# EAGLE design Bauble (EAGLE 7.6.0)

## Sheet 1 of 2
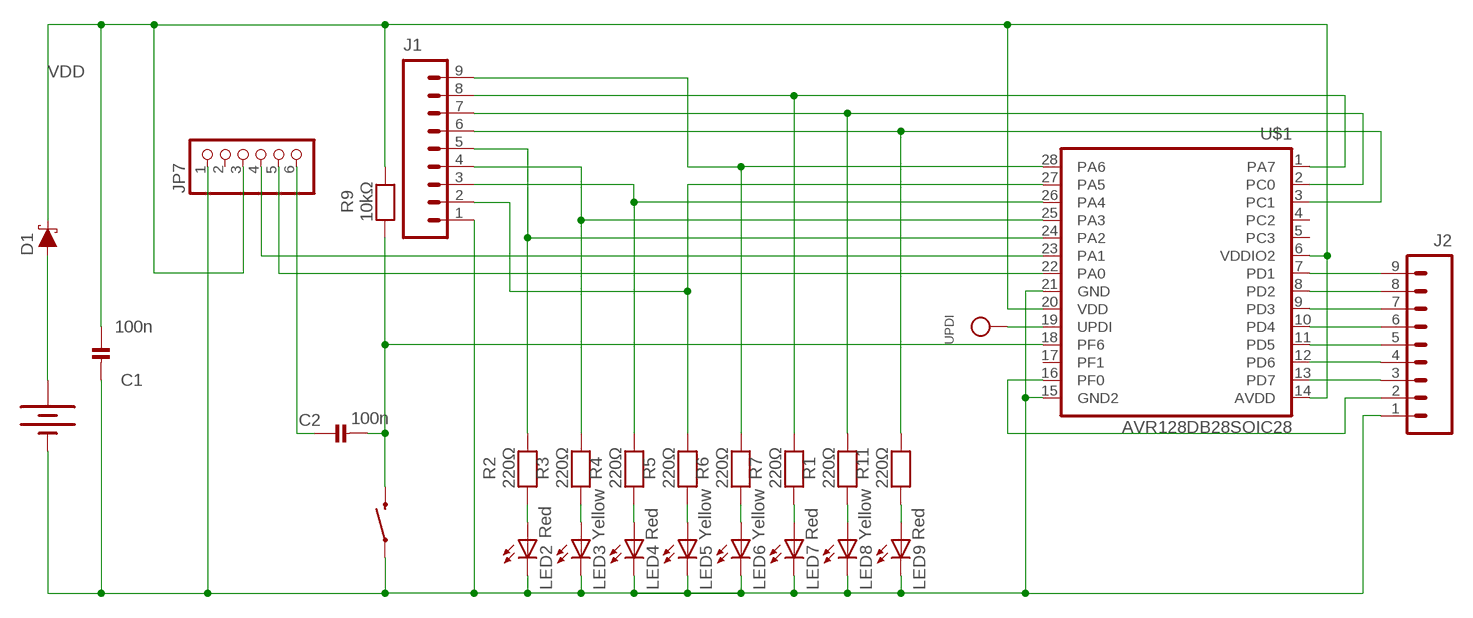
[diagram p0: schematic, sheet 1]

### Parts
BAT2  20mm coincell  BATTERY20MM_4LEGS  [BATTCON_20MM_4LEGS]
C1  100n  CAP_CERAMIC_0805MP  [_0805MP]
C2  100n  CAP_CERAMIC_0805MP  [_0805MP]
D1  3A/10V/280mV  DIODE-SCHOTTKY-BAT60A  [SOD-323]
J1  M82MM  [1X10-2MM]
J2  M82MM  [1X10-2MM]
JP7  HEADER-1X6ROUND  [1X06_ROUND]
LED2  Red  LEDCHIPLED_0805  [CHIPLED_0805]
LED3  Yellow  LEDCHIPLED_0805  [CHIPLED_0805]
LED4  Red  LEDCHIPLED_0805  [CHIPLED_0805]
LED5  Yellow  LEDCHIPLED_0805  [CHIPLED_0805]
LED6  Yellow  LEDCHIPLED_0805  [CHIPLED_0805]
LED7  Red  LEDCHIPLED_0805  [CHIPLED_0805]
LED8  Yellow  LEDCHIPLED_0805  [CHIPLED_0805]
LED9  Red  LEDCHIPLED_0805  [CHIPLED_0805]
R1  220Ω  RESISTOR_0805MP  [_0805MP]
R2  220Ω  RESISTOR_0805MP  [_0805MP]
R3  220Ω  RESISTOR_0805MP  [_0805MP]
R4  220Ω  RESISTOR_0805MP  [_0805MP]
R5  220Ω  RESISTOR_0805MP  [_0805MP]
R6  220Ω  RESISTOR_0805MP  [_0805MP]
R7  220Ω  RESISTOR_0805MP  [_0805MP]
R9  10kΩ  RESISTOR_0805MP  [_0805MP]
R11  220Ω  RESISTOR_0805MP  [_0805MP]
S2  SWITCH-MOMENTARY-2SMD  [TACTILE-SWITCH-SMD]
U$1  AVR128DB28SOIC28  [SO-28W]
UPDI  TESTPOINTROUND1MM  [TESTPOINT_ROUND_1MM]

### Nets
GND: BAT2.NEGATIVE(-) C1.2 J1.1 J2.1 JP7.1 LED2.C LED3.C LED4.C LED5.C LED6.C LED7.C LED8.C LED9.C S2.1 U$1.15(GND2) U$1.21(GND)
N$2: J2.2 U$1.16(PF0)
N$3: LED2.A R2.1
N$4: J1.8 R7.2 U$1.1(PA7)
N$5: LED3.A R3.1
N$6: J1.7 R1.2 U$1.2(PC0)
N$7: J1.5 R2.2 U$1.24(PA2)
N$8: C2.1 JP7.6
N$9: LED4.A R4.1
N$10: BAT2.POSITIVE@1(+) BAT2.POSITIVE@2(+) BAT2.POSITIVE@3(+) BAT2.POSITIVE@4(+) D1.A
N$11: LED5.A R5.1
N$12: LED6.A R6.1
N$13: LED7.A R7.1
N$15: J1.9 R6.2 U$1.28(PA6)
N$16: J1.3 R4.2 U$1.26(PA4)
N$17: J1.2 R5.2 U$1.27(PA5)
N$18: J1.4 R3.2 U$1.25(PA3)
N$19: J2.9 U$1.7(PD1)
N$20: U$1.19(UPDI) UPDI.P$1
N$24: J1.6 R11.2 U$1.3(PC1)
N$25: J2.8 U$1.8(PD2)
N$27: J2.7 U$1.9(PD3)
N$28: LED9.A R11.1
N$29: J2.6 U$1.10(PD4)
N$42: LED8.A R1.1
N$43: J2.5 U$1.11(PD5)
N$46: J2.4 U$1.12(PD6)
N$47: J2.3 U$1.13(PD7)
RESET: C2.2 R9.1 S2.3 U$1.18(PF6)
RX: JP7.4 U$1.23(PA1)
TX: JP7.5 U$1.22(PA0)
VDD: C1.1 D1.C JP7.3 R9.2 U$1.6(VDDIO2) U$1.14(AVDD) U$1.20(VDD)
Unconnected: JP7.2 U$1.4(PC2) U$1.5(PC3) U$1.17(PF1)

## Sheet 2 of 2

## Library data of the parts
BAT2 = SparkFun-Electromechanical:BATTERY: Battery Holders Various common sizes : AA, AAA, 18650 (PRT-12895), 20mm coin cell and 12mm coin cell. 20MM_4LEGS, BATT-10373; PROD_ID: BATT-10373
C1 C2 = microbuilder:CAP_CERAMIC: Ceramic Capacitors 0402 - 0402 Surface Mount Capacitors 16pF 50V 5% [Digikey: 445-4899-2-ND] 18pF 50V 5% [Digikey: 490-1281-2-ND] 22pF 50V 5% [Digikey: 490-1283-2-ND] 68pF 50V 5% [Digikey: 490-1289-2-ND] 0.1uF 10V 10% [Digikey: 490-1318-2-ND] 1.0uF 6.3V 10% [Digikey: 490-1320-2-ND] 0603 - 0603 Surface Mount Capacitors 16 pF 50V 5% [Digikey: 445-5051-2-ND] 22 pF 50V [Digikey: PCC220ACVTR-ND] 33 pF 50V 5% [Digikey: 490-1415-1-ND] 56pF 50V 5% [Digikey: 490-1421-1-ND] 220pF 50V 5% [Digikey: 445-1285-1-ND] 680 pF 50V 2200 pF 50V 5% C0G [Digikey: 445-1297-1-ND] 5600 pF 100V 5% X7R [Digikey: 478-3711-1-ND] 0.1 µF 25V 10% [Digikey: PCC2277TR-ND] 0.22 µF 16V 10% X7R [Digikey: 445-1318-1-ND] 1.0 µF 25V 10% [Digikey: 445-5146-2-ND] 0603 - RF Specific 3pF 250V +/-0.1pF RF [Digikey: 712-1347-1-ND] 18 pF 250V 5% [Digikey: 478-3505-1-ND or 712-1322-1-ND] 56 pF 250V 5% C0G RF [Digikey: 490-4867-1-ND] 68 pF 250V RF [Digikey: 490-4868-1-ND] 0805 - 0805 Surface Mount Capacitors 220 pF 250V 2% RF Ceramic Capacitor [Digikey: 712-1398-1-ND] 1000 pF 50V 2% NP0 Ceramic Capacitor [Digikey: 478-3760-1-ND] 0.1 µF 25V 10% Ceramic Capacitor [Digikey: PCC1828TR-ND] 1.0 µF 16V 10% Ceramic Capacitor[Digikey: 490-1691-2-ND] 10.0 µF 10V 10% Ceramic Capacitor[Digikey: 709-1228-1-ND] 10.0 uF 16V 10% Ceramic Capacitor [Digikey: 478-5165-2-ND] 47 uF 6.3V 20% Ceramic Capacitor [Digikey: 587-1779-1-ND or 399-5506-1-ND] 1206 - 1206 Surface Mount Capacitors 47uF 10V 20% Ceramic Capacitor [Digikey: 490-5528-1-ND or 399-5508-1-ND or 445-6010-1-ND] 100uF 6.3V -20%, +80% Y5V Ceramic Capacitor (Digikey: 490-4512-1-ND, Mouser: 81-GRM31CF50J107ZE1L)
D1 = SparkFun-DiscreteSemi:DIODE-SCHOTTKY: Schottky diode A Schottky diode is a semiconductor diode which has a low forward voltage drop and a very fast switching action.; PROD_ID: DIO-14072
J1 J2 = technoblogy:M8: Header 10 Standard 10-pin 0.1" header. Use with straight break away headers (SKU : PRT-00116), right angle break away headers (PRT-00553), swiss pins (PRT-00743), machine pins (PRT-00117), and female headers (PRT-00115).
JP7 = technoblogy:HEADER-1X6: PIN HEADER
LED2-LED9 = adafruit:LED: LED OSRAM: - CHIPLED LG R971, LG N971, LY N971, LG Q971, LY Q971, LO R971, LY R971 LH N974, LH R974 LS Q976, LO Q976, LY Q976 LO Q996 - Hyper CHIPLED LW Q18S LB Q993, LB Q99A, LB R99A - SideLED LS A670, LO A670, LY A670, LG A670, LP A670 LB A673, LV A673, LT A673, LW A673 LH A674 LY A675 LS A676, LA A676, LO A676, LY A676, LW A676 LS A679, LY A679, LG A679 - Hyper Micro SIDELED® LS Y876, LA Y876, LO Y876, LY Y876 LT Y87S - SmartLED LW L88C, LW L88S LB L89C, LB L89S, LG L890 LS L89K, LO L89K, LY L89K LS L896, LA L896, LO L896, LY L896 - TOPLED LS T670, LO T670, LY T670, LG T670, LP T670 LSG T670, LSP T670, LSY T670, LOP T670, LYG T670 LG T671, LOG T671, LSG T671 LB T673, LV T673, LT T673, LW T673 LH T674 LS T676, LA T676, LO T676, LY T676, LB T676, LH T676, LSB T676, LW T676 LB T67C, LV T67C, LT T67C, LS T67K, LO T67K, LY T67K, LW E67C LS E67B, LA E67B, LO E67B, LY E67B, LB E67C, LV E67C, LT E67C LW T67C LS T679, LY T679, LG T679 LS T770, LO T770, LY T770, LG T770, LP T770 LB T773, LV T773, LT T773, LW T773 LH T774 LS E675, LA E675, LY E675, LS T675 LS T776, LA T776, LO T776, LY T776, LB T776 LHGB T686 LT T68C, LB T68C - Hyper Mini TOPLED® LB M676 - Mini TOPLED Santana® LG M470 LS M47K, LO M47K, LY M47K Source: http://www.osram.convergy.de/
R1-R7 R9 R11 = microbuilder:RESISTOR: Resistors 0402 - 0402 Surface Mount Package 22 Ohm 1% 1/16W [Digikey: 311-22.0LRTR-ND] 33 Ohm 5% 1/16W 1.0K 5% 1/16W 1.5K 5% 1/16W 2.0K 1% 1/16W 10.0K 1% 1/16W [Digikey: 311-10.0KLRTR-ND] 10.0K 5% 1/16W [Digikey: RMCF0402JT10K0TR-ND] 12.1K 1% 1/16W [Digikey: 311-22.0LRTR-ND] 100.0K 5% 1/16W 0603 - 0603 Surface Mount Package 0 Ohm 1/10 Watt 1% Resistor 15 Ohm 1/10 Watt 1% Resistor 33 Ohm 1/10 Watt 1% Resistor 49.9 Ohm 1/10 Watt 1% Resistor 100 Ohm 1/10 Watt 1% Resistor 150 Ohm 1/10 Watt 1% Resistor 240 Ohm 1/10 Watt 1% Resistor 390 Ohm 1/10 Watt 1% Resistor 560 Ohm 1/10 Watt 1% Resistor 680 Ohm 1/10 Watt 1% Resistor 750 Ohm 1/10 Watt 1% Resistor 1.0K Ohm 1/10 Watt 1% Resistor 1.5K Ohm 1/10 Watt 1% Resistor 2.0K Ohm 1/10 Watt 1% Resistor 2.2K Ohm 1/10 Watt 1% Resistor 3.3K Ohm 1/10 Watt 1% Resistor 4.7K Ohm 1/10 Watt 1% Resistor 10.0K Ohm 1/10 Watt 1% Resistor 12.0K Ohm 1/10 Watt 1% Resistor 12.1K Ohm 1/10 Watt 1% Resistor 20.0K Ohm 1/10 Watt 1% Resistor 33.0K Ohm 1/10 Watt 1% Resistor 100.0K Ohm 1/10 Watt 1% Resistor 0805 - 0805 Surface Mount Package 0 Ohm 1/8 Watt 1% Resistor 33 Ohm 1/8 Watt 1% Resistor 100 Ohm 1/8 Watt 1% Resistor 150 Ohm 1/8 Watt 1% Resistor 200 Ohm 1/8 Watt 1% Resistor 240 Ohm 1/8 Watt 1% Resistor 330 Ohm 1/8 Watt 1% Resistor 390 Ohm 1/8 Watt 1% Resistor 470 Ohm 1/8 Watt 1% Resistor 1.0K Ohm 1/8 Watt 1% Resistor 1.5K Ohm 1/8 Watt 1% Resistor 2.0K Ohm 1/8 Watt 1% Resistor 4.7K Ohm 1/8 Watt 1% Resistor 5.1K Ohm 1/8 Watt 1% Resistor 5.6K Ohm 1/8 Watt 1% Resistor 10.0K Ohm 1/8 Watt 1% Resistor 22.0K Ohm 1/8 Watt 1% Resistor 33.0K Ohm 1/8 Watt 1% Resistor 100K Ohm 1/8 Watt 1% Resistor 1206 - 1206 Surface Mount Package 2012 - 2010 Surface Mount Package 0.11 Ohm 1/2 Watt 1% Resistor - Digikey: RHM.11UCT-ND
S2 = SparkFun-Electromechanical:SWITCH-MOMENTARY-2: Various NO switches- pushbuttons, reed, etc; PROD_ID: SWCH-08247
U$1 = technoblogy:AVR128DB28
UPDI = microbuilder:TESTPOINT: Test Point Various test points for characterisation and PCB testing TESTPOINT_SMT - Compact Surface Mount Test Point [Digikey: 5016KTR-ND]

## Net classes
0 default: width 0.152 mm, drill 0.305 mm, clearance 0.152 mm

## Board
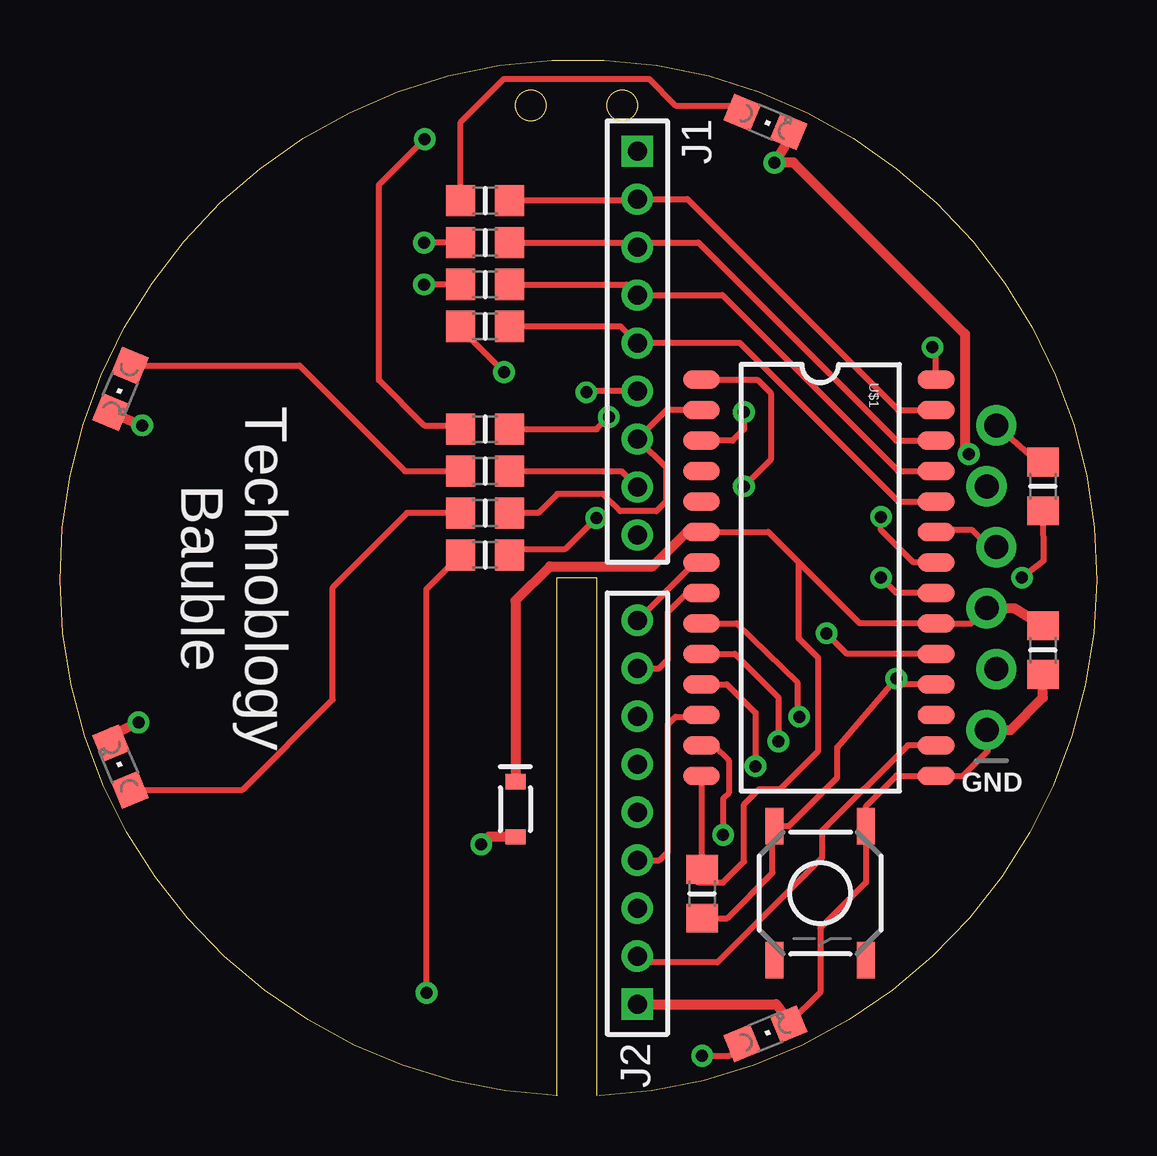
[diagram p1: board, top side]
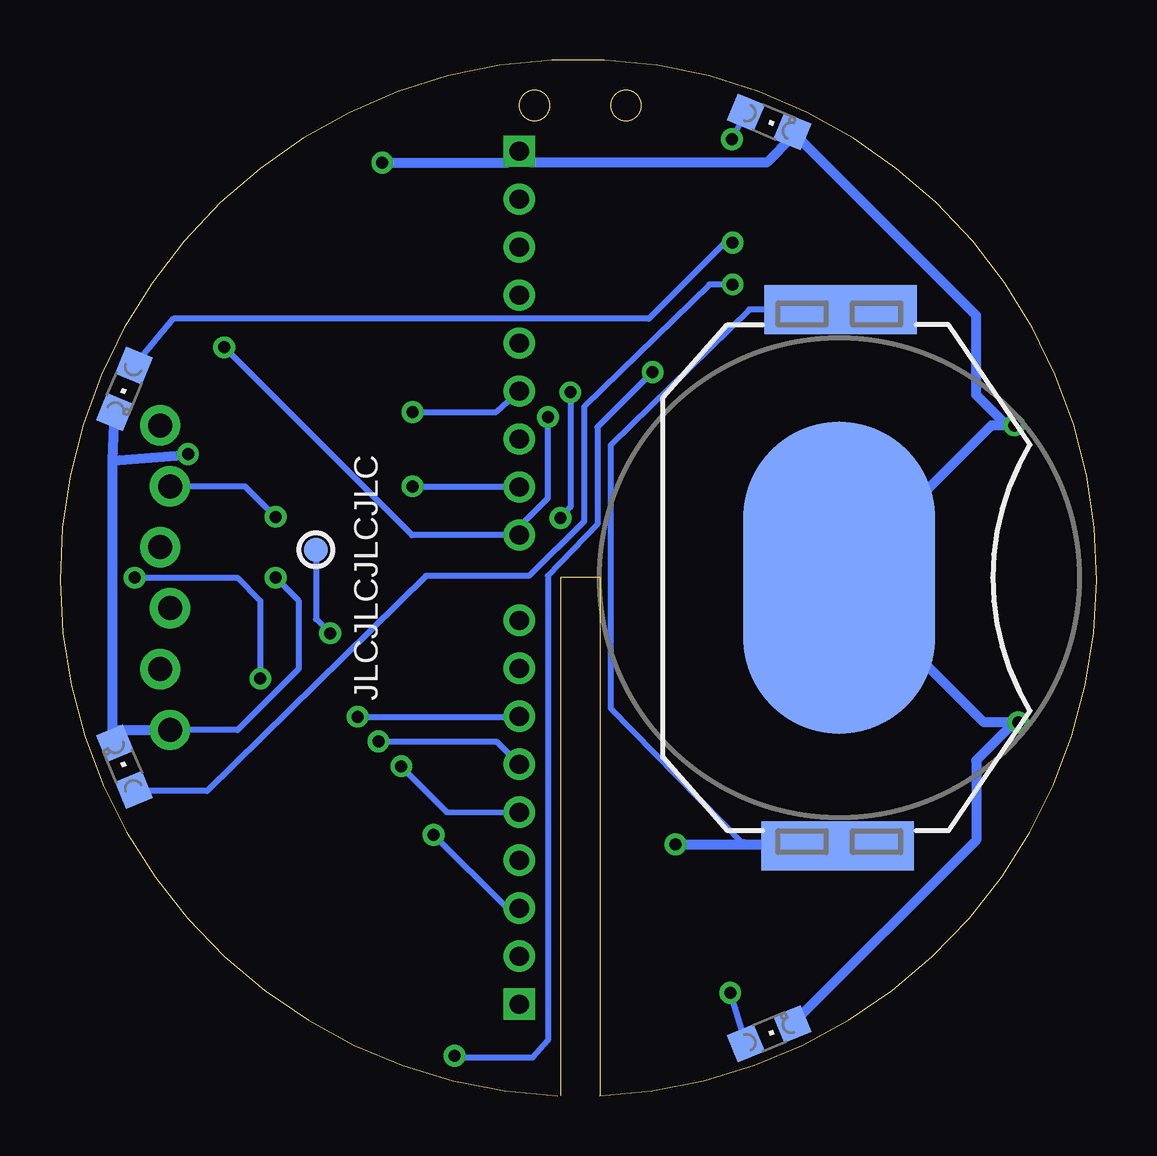
[diagram p2: board, bottom side, seen from below]

Size 43.22 x 43.17 mm. Coordinates in mm from the lower left corner, seen from the top.
Outline: 22.36,0 22.36,21.59 20.7,21.59 20.7,0
Outline: 20.74,0 arc-355 22.48,0
Outline: circle at 19.62,41.27 radius 0.64
Outline: circle at 23.43,41.27 radius 0.64
Copper layers (1*16): Top 0.035mm / dielectric 1.5mm / Bottom 0.035mm
Design rules "default *": minimum track width 10mil, minimum drill 24mil, track to track 8mil, track to pad 8mil, pad to pad 8mil, via to via 8mil, smd to smd 8mil, copper to edge 40mil, drill to drill 8mil, minimum pad ring 10mil, minimum via ring 8mil, stop-mask expansion 4mil, vias tented up to drill 20mil, thermal gap 10mil

### Footprints (pad centres in the part's own frame; a part is rotated, then mirrored left to right if it is on the bottom)
BATTCON_20MM_4LEGS = smd 13 x 8: NEGATIVE 0,0 | smd 2.032 x 3.175: POSITIVE@1 -11.176,1.651; POSITIVE@2 -11.176,-1.524; POSITIVE@3 11.176,1.524; POSITIVE@4 11.176,-1.651
_0805MP = smd 1.2 x 1.3: 1 -1.016,0; 2 1.016,0
SOD-323 = smd 0.63 x 0.83: A 1.15,0; C -1.15,0
1X10-2MM = drill 0.8 square: 1 0,0 | drill 0.8: 2 2,0; 3 4,0; 4 6,0; 5 8,0; 6 10,0; 7 12,0; 8 14,0; 9 16.002,0
1X06_ROUND = drill 1 pad 1.676: 1 -6.35,0.203; 2 -3.81,-0.203; 3 -1.27,0.203; 4 1.27,-0.203; 5 3.81,0.203; 6 6.35,-0.203
CHIPLED_0805 = smd 1.2 x 1.2: A 0,-1.05; C 0,1.05
TACTILE-SWITCH-SMD = smd 1.524 x 0.762: 1 -2.794,1.905; 2 2.794,1.905; 3 -2.794,-1.905; 4 2.794,-1.905
SO-28W = smd 0.762 x 1.524: 1 -8.255,-4.953; 2 -6.985,-4.953; 3 -5.715,-4.953; 4 -4.445,-4.953; 5 -3.175,-4.953; 6 -1.905,-4.953; 7 -0.635,-4.953; 8 0.635,-4.953; 9 1.905,-4.953; 10 3.175,-4.953; 11 4.445,-4.953; 12 5.715,-4.953; 13 6.985,-4.953; 14 8.255,-4.953; 15 8.255,4.826; 16 6.985,4.826; 17 5.715,4.826; 18 4.445,4.826; 19 3.175,4.826; 20 1.905,4.826; 21 0.635,4.826; 22 -0.635,4.826; 23 -1.905,4.826; 24 -3.175,4.826; 25 -4.445,4.826; 26 -5.715,4.826; 27 -6.985,4.826; 28 -8.255,4.826
TESTPOINT_ROUND_1MM = smd 1 x 1: P$1 0,0

### Placement (x,y rotation side)
BAT2  10.73,21.59 90 bottom
C1  40.98,18.57 270 top
C2  40.98,25.4 270 top
D1  18.99,11.94 270 top
J1  24.07,39.37 270 top
J2  24.07,3.81 90 top
JP7  38.83,21.59 90 top
LED2  29.4,2.58 292.5 top
LED3  40.53,13.72 22.5 bottom
LED4  40.53,29.46 157.5 bottom
LED5  29.4,40.59 247.5 top
LED6  13.66,40.59 247.5 bottom
LED7  2.52,29.46 157.5 top
LED8  2.52,13.72 22.5 top
LED9  13.66,2.58 292.5 bottom
R1  17.72,24.29 0 top
R2  17.72,32.07 0 top
R3  17.72,33.81 0 top
R4  17.72,35.56 0 top
R5  17.72,37.31 0 top
R6  17.72,27.78 0 top
R7  17.72,26.04 0 top
R9  26.77,8.41 90 top
R11  17.72,22.54 0 top
S2  31.69,8.45 270 top
U$1  31.69,21.59 270 top
UPDI  32.55,22.76 0 bottom

### Tracks (layer width: path | path; a pad name or v marks a point on that pad's centre or on a via)
GND  (via drill 0.5)
  Top 0.254: LED8.C 2.12,15.24 2.28,15.08 | 30.19,39.53 LED5.C | 30.42,3.03 LED2.C 31.69,4.3 31.69,6.99 33.59,8.89 S2.1 33.59,12.06 34.86,13.34 U$1.15 37.64,13.34 38.67,14.37 38.67,15.2 JP7.1 | U$1.21 34.86,20.95 v34.23,21.59
  Top 0.406: 30.19,39.53 v29.78,38.89 30.58,38.89 37.72,31.75 37.72,26.91 v37.88,26.75 | v3.27,15.56 2.28,15.08 | LED7.C v3.43,27.94 | J2.1 29.86,3.81 30.42,3.03 | JP7.1 39.63,15.24 40.98,16.59 C1.2
  Bottom 0.254: JP7.1 35.82,15.24 33.28,17.78 33.28,20.64 v34.23,21.59 | LED3.C 41.04,15.24 | LED6.C 12.72,39.92 | v3.27,15.56 3.43,15.56 | v3.43,27.94 3.75,27.94
  Bottom 0.406: 12.72,39.92 13.75,38.89 23.59,38.89 J1.1 24.55,38.89 v29.78,38.89 | v3.27,15.56 4.7,15.56 BAT2.NEGATIVE 4.38,27.94 v3.43,27.94 | 3.43,15.56 5.02,13.97 5.02,10.65 LED9.C | 3.75,27.94 5.02,29.21 5.02,32.52 LED6.C | 41.01,26.46 41.01,14.77 LED3.C | 41.01,26.46 LED4.C | 41.04,15.24 39.98,15.24 JP7.1 | 41.01,26.46 38.09,26.7 v37.88,26.75
N$2
  Top 0.254: U$1.16 35.34,14.61 31.77,11.03 31.77,9.92 27.4,5.56 24.32,5.56 J2.2
N$3  (via drill 0.5)
  Top 0.254: R2.1 16.7,31.97 v18.51,30.16 | v26.77,1.67 27.92,1.67 LED2.A
  Bottom 0.254: v18.51,30.16 20.82,27.86 20.82,23.81 22.88,21.67 22.88,2.3 23.51,1.59 26.69,1.59 v26.77,1.67
N$4  (via drill 0.5)
  Top 0.254: J1.8 23.4,26.04 R7.2 | U$1.1 29.07,29.84 29.63,29.29 29.63,26.51 v28.51,25.4
  Bottom 0.254: v28.51,25.4 24.1,25.4 J1.8
N$5  (via drill 0.5)
  Top 0.254: R3.1 v15.18,33.81
  Bottom 0.254: v15.18,33.81 16.15,33.81 21.37,28.72 21.37,23.94 23.67,21.67 27.96,21.67 37.09,12.7 40.13,12.7 LED3.A
N$6
  Top 0.254: 18.89,24.37 R1.2 19.94,24.29 20.74,25.08 22.64,25.08 23.36,24.37 24.86,24.37 25.26,24.77 25.26,26.19 24.16,27.29 24.16,27.38 J1.7 25.27,28.57 U$1.2
N$7
  Top 0.254: U$1.24 34.94,24.77 28.34,31.37 J1.5 23.37,32.07 R2.2
N$8
  Top 0.254: C2.1 40.74,26.43 JP7.6
N$9  (via drill 0.5)
  Top 0.254: R4.1 v15.18,35.56
  Bottom 0.254: v15.18,35.56 15.5,35.56 18.67,32.38 38.49,32.38 LED4.A
N$10  (via drill 0.5)
  Top 0.406: D1.A 17.87,10.79 v17.56,10.48
  Bottom 0.254: 11.62,10.41 BAT2.POSITIVE@1 12.45,10.48 11.69,10.48 11.62,10.41 | 11.62,10.41 11.37,10.16 9.46,10.16 BAT2.POSITIVE@2 | BAT2.POSITIVE@4 BAT2.POSITIVE@3 14.48,32.77 20.26,27.11 20.26,16.16 14.7,10.48
  Bottom 0.406: v17.56,10.48 14.7,10.48 12.45,10.48
N$11
  Top 0.254: R5.1 16.7,40.58 18.51,42.39 24.55,42.39 25.66,41.27 28.15,41.27 LED5.A
N$12  (via drill 0.5)
  Top 0.254: R6.1 16.54,27.94 15.18,27.94 13.3,29.82 13.3,37.96 v15.21,39.87
  Bottom 0.254: LED6.A v15.21,39.87
N$13
  Top 0.254: LED7.A 9.99,30.43 14.39,26.04 R7.1
N$15  (via drill 0.5)
  Top 0.254: U$1.28 36.52,31.05 v36.37,31.19 | R6.2 22.37,27.78 v22.88,28.29
  Bottom 0.254: v22.88,28.29 22.88,24.91 24.07,23.72 J1.9 28.55,23.37 v36.37,31.19
N$16
  Top 0.254: R4.2 23.88,35.56 J1.3 24.07,35.56 26.61,35.56 34.86,27.3 U$1.26
N$17
  Top 0.254: R5.2 24.01,37.31 J1.2 26.15,37.37 34.94,28.57 U$1.27
N$18
  Top 0.254: R3.2 23.63,33.81 J1.4 27.61,33.37 34.94,26.04 U$1.25
N$19
  Top 0.254: U$1.7 26.37,22.23 26.37,22.11 J2.9 24.1,19.84
N$20  (via drill 0.5)
  Top 0.254: U$1.19 32.81,18.41 v31.95,19.27 31.91,19.27
  Bottom 0.254: UPDI.P$1 32.55,19.86 v31.95,19.27
N$24  (via drill 0.5)
  Top 0.254: J1.6 22.34,29.37 v21.94,29.32 | R11.2 18.67,22.48 18.93,22.8 21.07,22.8 v22.36,24.08 | v28.51,28.5 28.51,27.78 28.04,27.3 U$1.3
  Bottom 0.254: v28.51,28.5 25.02,28.5 J1.6 | v21.94,29.32 21.94,24.53 v22.36,24.08
N$25
  Top 0.254: J2.8 24.97,17.81 25.34,18.18 25.34,20.16 26.21,21.03 26.66,21.03 U$1.8
N$27  (via drill 0.5)
  Top 0.254: U$1.9 28.2,19.68 30.74,17.22 30.74,15.88 v30.82,15.8
  Bottom 0.254: v30.82,15.8 24.08,15.8 J2.7
N$28  (via drill 0.5)
  Top 0.254: v15.28,4.28 15.28,21.12 R11.1
  Bottom 0.254: LED9.A v15.28,4.28
N$29  (via drill 0.5)
  Top 0.254: U$1.10 28.13,18.41 29.94,16.61 v29.94,14.76
  Bottom 0.254: J2.6 25.02,14.76 v29.94,14.76
N$42
  Top 0.254: R1.1 14.47,24.29 11.37,21.19 11.37,16.51 7.61,12.75 LED8.A
N$43  (via drill 0.5)
  Top 0.254: U$1.11 27.8,17.14 28.99,15.95 v28.99,13.73
  Bottom 0.254: v28.99,13.73 27.1,11.83 J2.5
N$46
  Top 0.254: J2.4 24.99,9.81 25.34,10.16 25.34,15.48 25.66,15.8 26.66,15.8 U$1.12
N$47  (via drill 0.5)
  Top 0.254: v27.64,10.87 27.64,12.38 27.88,12.62 27.88,13.97 27.24,14.61 U$1.13
  Bottom 0.254: v27.64,10.87 24.59,7.86 J2.3
RESET  (via drill 0.5)
  Top 0.254: C2.2 40.99,22.29 v40.1,21.59 | R9.1 27.82,7.4 29.71,9.29 29.71,11.16 S2.3 30.39,11.24 32.4,13.26 32.4,14.53 v34.86,17.38 35.1,17.14 U$1.18
  Bottom 0.254: v40.1,21.59 35.82,21.59 34.86,20.64 v34.86,17.38
RX
  Top 0.254: U$1.23 36.59,23.57 38.04,23.57 38.75,22.86 JP7.4
TX  (via drill 0.5)
  Top 0.254: U$1.22 35.58,22.23 34.23,23.57 v34.23,24.13
  Bottom 0.254: v34.23,24.13 35.5,25.4 JP7.5
VDD
  Top 0.254: JP7.3 38,19.68 U$1.20 33.34,19.68 30.8,22.23 | R9.2 26.74,9.72 U$1.14 26.74,9.02 26.61,8.89 27.64,8.89 28.51,9.76 28.51,12.14 29.15,12.78 30.02,12.78 31.61,14.37 31.61,18.24 30.8,19.05 30.8,22.23 | U$1.6 29.53,23.5 30.8,22.23
  Top 0.406: JP7.3 39.79,20.32 C1.1 | D1.C 18.99,20.64 20.42,22.07 24.7,22.07 26.13,23.5 U$1.6

### Text on the board
tPlace: Technoblogy / Bauble | GND
bPlace: JLCJLCJLCJLC